# Altium project FourRotorV2.1.PrjPCB
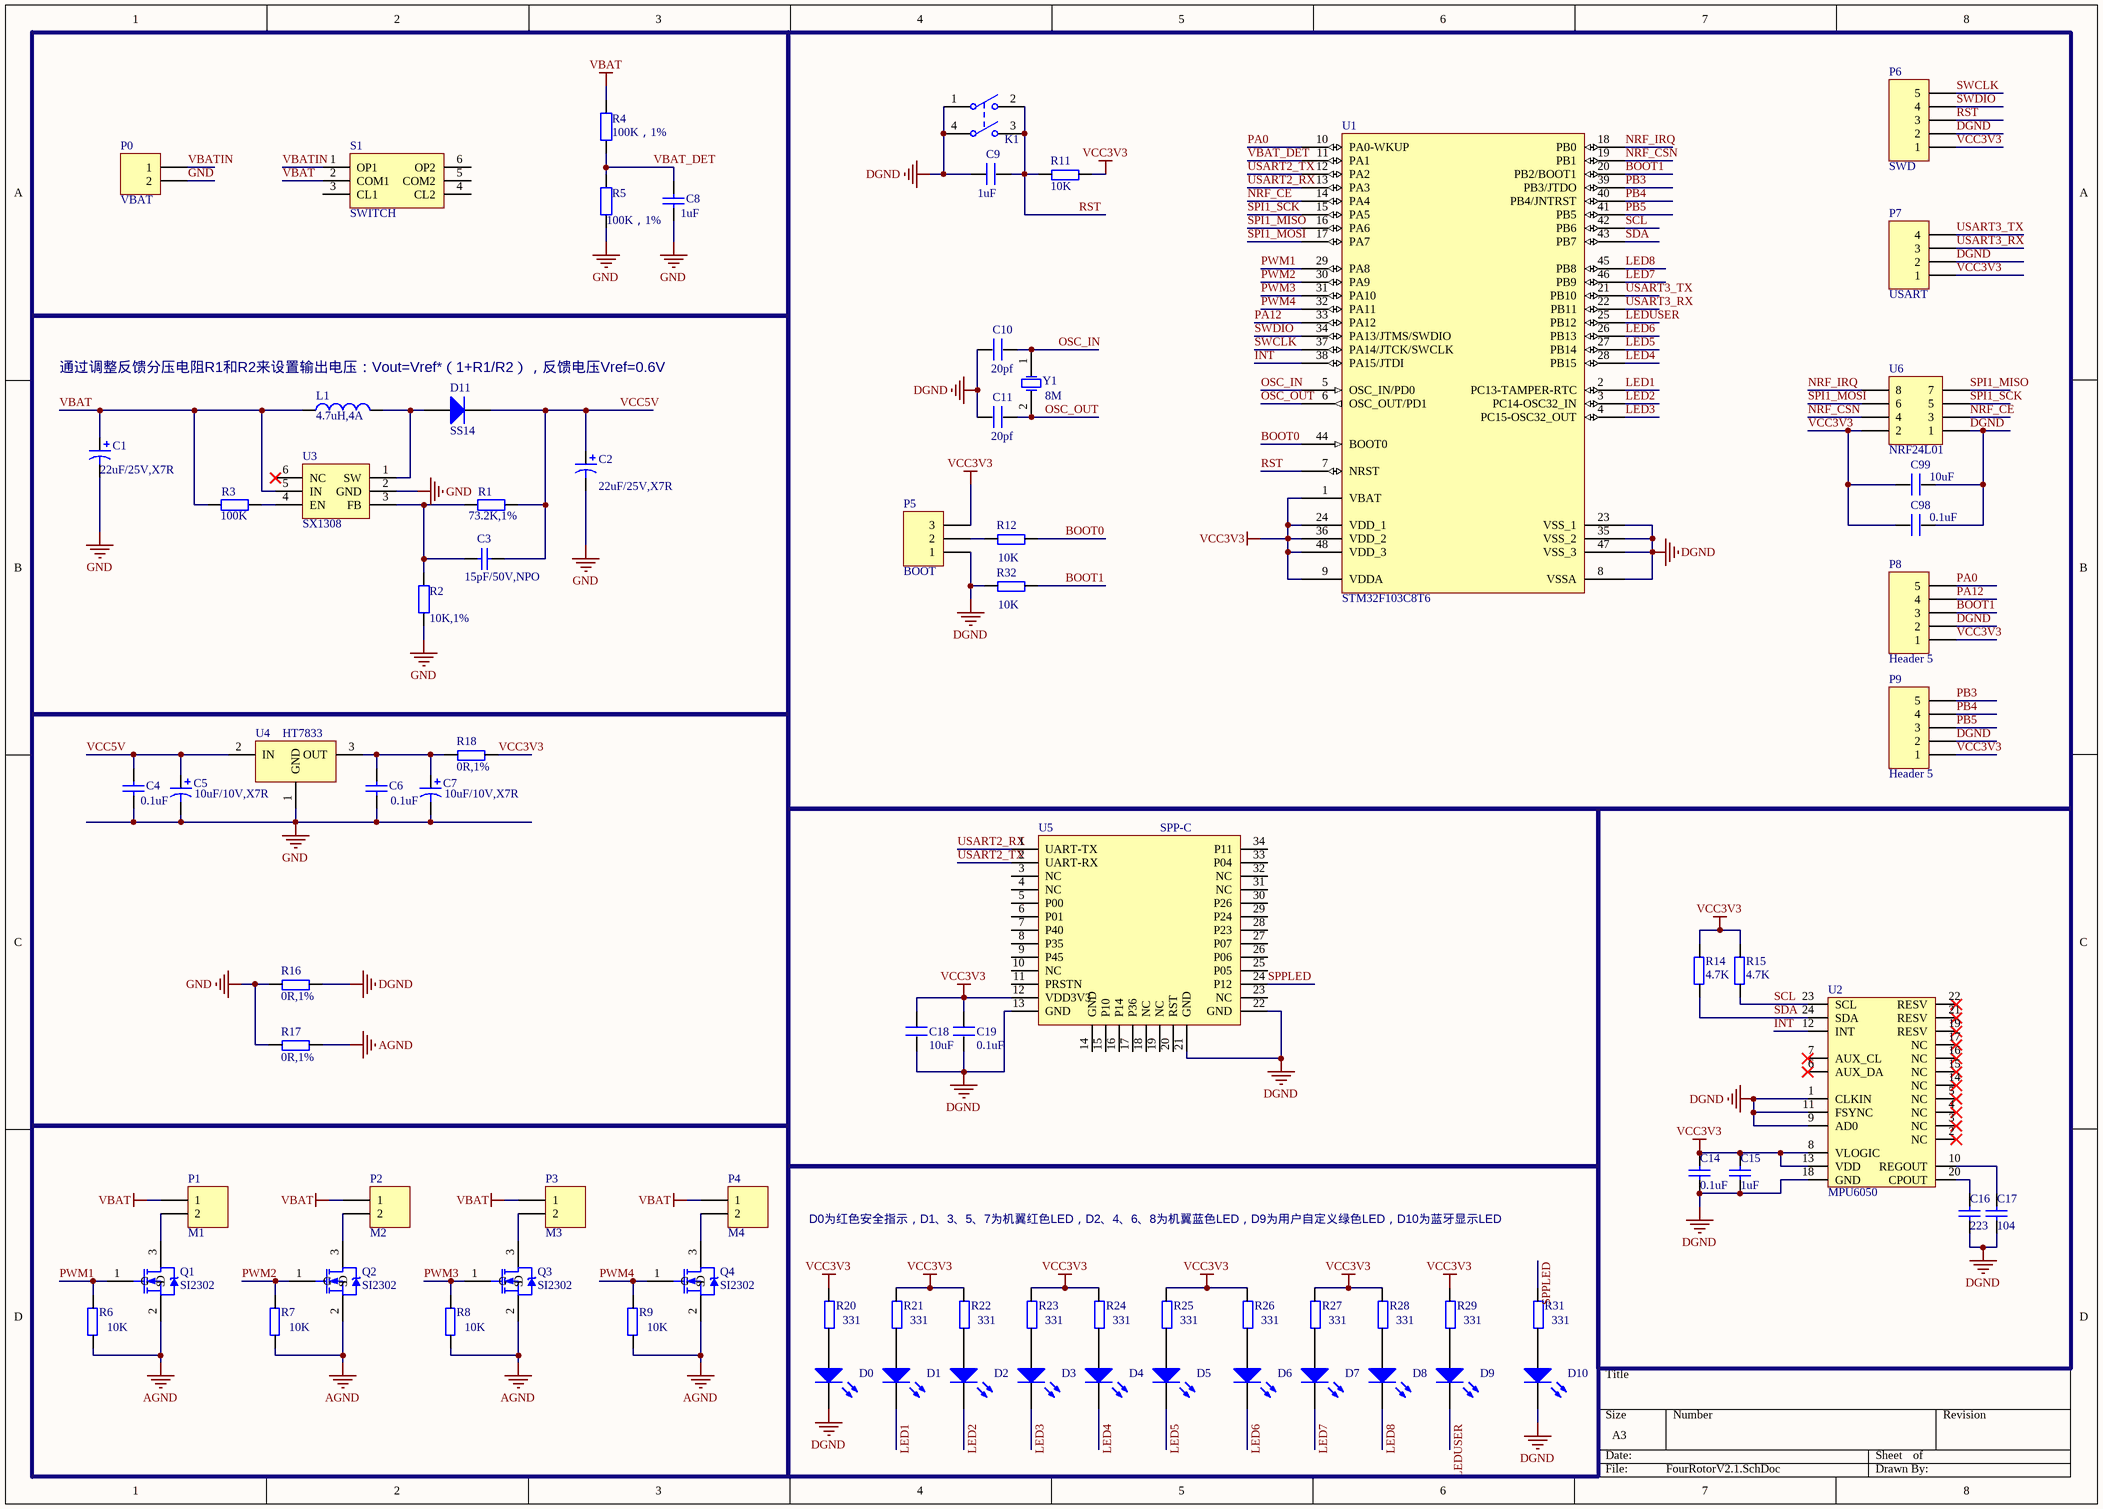
[diagram p0: FourRotorV2.1.SchDoc]
1 sheet, 83 parts. Net scope: global (net labels, ports and power ports of the same name join across sheets).
Board file: FortRotorV2.1.PcbDoc

## Sheet FourRotorV2.1.SchDoc
size A3

### Parts
C1  value 22uF/25V,X7R  [LC-1206_C]  (hidden comment: Cap Pol1)
C2  value 22uF/25V,X7R  [LC-1206_C]  (hidden comment: Cap Pol1)
C3  value 15pF/50V,NPO  [LC-0603_C]  (hidden comment: Cap)
C4  value 0.1uF  [LC-0603_C]  (hidden comment: Cap)
C5  value 10uF/10V,X7R  [LC-1206_C]  (hidden comment: Cap Pol1)
C6  value 0.1uF  [LC-0603_C]  (hidden comment: Cap)
C7  value 10uF/10V,X7R  [LC-1206_C]  (hidden comment: Cap Pol1)
C8  value 1uF  [LC-0603_C]  (hidden comment: Cap)
C9  1uF  [LC-0603_C]
C10  value 20pf  [LC-0603_C]
C11  value 20pf  [LC-0603_C]
C14  value 0.1uF  [LC-0603_C]
C15  value 1uF  [LC-0603_C]
C16  value 223  [LC-0603_C]
C17  value 104  [LC-0603_C]
C18  value 10uF  [LC-0805_C]
C19  value 0.1uF  [LC-0603_C]
C98  value 0.1uF  [LC-0603_C]  (hidden comment: 1uF)
C99  value 10uF  [LC-0805_C]  (hidden comment: 1uF)
D0  LED0  [LC-0805_LED_S1]  (value not drawn)
D1  LED0  [LC-0805_LED_S1]  (value not drawn)
D2  LED0  [LC-0805_LED_S1]  (value not drawn)
D3  LED0  [LC-0805_LED_S1]  (value not drawn)
D4  LED0  [LC-0805_LED_S1]  (value not drawn)
D5  LED0  [LC-0805_LED_S1]  (value not drawn)
D6  LED0  [LC-0805_LED_S1]  (value not drawn)
D7  LED0  [LC-0805_LED_S1]  (value not drawn)
D8  LED0  [LC-0805_LED_S1]  (value not drawn)
D9  LED0  [LC-0805_LED_S1]  (value not drawn)
D10  LED0  [LC-0805_LED_S1]  (value not drawn)
D11  SS14  [LC-DO-214AC]
K1  SW-DPST  [SWITCH2]  (value not drawn)
L1  value 4.7uH,4A  [LC-1812_L]  (hidden comment: Inductor)
P0  VBAT  [HDR1X2]
P1  M1  [HDR1X2]
P2  M2  [HDR1X2]
P3  M3  [HDR1X2]
P4  M4  [HDR1X2]
P5  BOOT  [HDR1X3]
P6  SWD  [HDR1X5]
P7  USART  [HDR1X4]
P8  Header 5  [HDR1X5]
P9  Header 5  [HDR1X5]
Q1  SI2302  [LC-SOT-23(SOT-23-3)]
Q2  SI2302  [LC-SOT-23(SOT-23-3)]
Q3  SI2302  [LC-SOT-23(SOT-23-3)]
Q4  SI2302  [LC-SOT-23(SOT-23-3)]
R1  value 73.2K,1%  [LC-0603_R]  (hidden comment: Res2)
R2  value 10K,1%  [LC-0603_R]  (hidden comment: Res2)
R3  value 100K  [LC-0603_R]  (hidden comment: Res2)
R4  value 100K，1%  [LC-0603_R]  (hidden comment: Res2)
R5  value 100K，1%  [LC-0603_R]  (hidden comment: Res2)
R6  value 10K  [LC-0603_R]
R7  value 10K  [LC-0603_R]
R8  value 10K  [LC-0603_R]
R9  value 10K  [LC-0603_R]
R11  10K  [LC-0603_R]
R12  value 10K  [LC-0603_R]
R14  value 4.7K  [LC-0603_R]
R15  value 4.7K  [LC-0603_R]
R16  value 0R,1%  [LC-0805_R]
R17  value 0R,1%  [LC-0805_R]
R18  value 0R,1%  [LC-0805_R]
R20  value 331  [LC-0603_R]
R21  value 331  [LC-0603_R]
R22  value 331  [LC-0603_R]
R23  value 331  [LC-0603_R]
R24  value 331  [LC-0603_R]
R25  value 331  [LC-0603_R]
R26  value 331  [LC-0603_R]
R27  value 331  [LC-0603_R]
R28  value 331  [LC-0603_R]
R29  value 331  [LC-0603_R]
R31  value 331  [LC-0603_R]
R32  value 10K  [LC-0603_R]
S1  SWITCH  [SWITCH_6]
U1  STM32F103C8T6  [LC-LQFP-48_7x7x05P]
U2  MPU6050  [LC-QFN-24_4x4x05P]
U3  SX1308  [LC-SOT-23-6]
U4  HT7833  [LC-SOT-89(SOT-89-3)]
U5  SPP-C  [SPP-C]
U6  NRF24L01  [LC-HDR2X4H]
Y1  (no value)  [LC-HC-49S]

### Blocks framed on the sheet
通过调整反馈分压电阻R1和R2来设置输出电压：Vout=Vref*（1+R1/R2），反馈电压Vref=0.6V: C1-C3 D11 L1 R1-R3 U3

### Nets
AGND: Q1.2(S) Q2.2(S) Q3.2(S) Q4.2(S) R6.2 R7.2 R8.2 R9.2 R17.2
DGND: C9.1 C10.1 C11.1 C14.1 C15.1 C16.1 C17.1 C18.1 C19.1 C98.2 C99.2 D0.2(K) D10.2(K) K1.1(COMMON1) K1.4(COMMON2) P5.1 P6.2 P7.2 P8.2 P9.2 R16.2 R32.1 U1.8(VSSA) U1.23(VSS_1) U1.35(VSS_2) U1.47(VSS_3) U2.1(CLKIN) U2.9(AD0) U2.11(FSYNC) U2.18(GND) U5.13(GND) U5.21(GND) U5.22(GND) U6.1
GND: C1.2 C2.2 C4.1 C5.2 C6.1 C7.2 C8.1 P0.2 R2.1 R5.1 R16.1 R17.1 U3.2(GND) U4.1(GND)
VBAT: C1.1 L1.1 P1.1 P2.1 P3.1 P4.1 R3.1 R4.2 S1.2(COM1) U3.5(IN)
VCC3V3: C14.2 C15.2 C18.2 C19.2 C98.1 C99.1 P5.3 P6.1 P7.1 P8.1 P9.1 R11.2 R14.1 R15.1 R18.2 R20.2 R21.2 R22.2 R23.2 R24.2 R25.2 R26.2 R27.2 R28.2 R29.2 U1.1(VBAT) U1.9(VDDA) U1.24(VDD_1) U1.36(VDD_2) U1.48(VDD_3) U2.8(VLOGIC) U2.13(VDD) U5.12(VDD3V3) U6.2
BOOT0: R12.2 U1.44(BOOT0)
BOOT1: P8.3 R32.2 U1.20(PB2/BOOT1)
INT: U1.38(PA15/JTDI) U2.12(INT)
LED1: D1.2(K) U1.2(PC13-TAMPER-RTC)
LED2: D2.2(K) U1.3(PC14-OSC32_IN)
LED3: D3.2(K) U1.4(PC15-OSC32_OUT)
LED4: D4.2(K) U1.28(PB15)
LED5: D5.2(K) U1.27(PB14)
LED6: D6.2(K) U1.26(PB13)
LED7: D7.2(K) U1.46(PB9)
LED8: D8.2(K) U1.45(PB8)
LEDUSER: D9.2(K) U1.25(PB12)
NRF_CE: U1.14(PA4) U6.3
NRF_CSN: U1.19(PB1) U6.4
NRF_IRQ: U1.18(PB0) U6.8
OSC_IN: C10.2 U1.5(OSC_IN/PD0) Y1.1(OSC1)
OSC_OUT: C11.2 U1.6(OSC_OUT/PD1) Y1.2(OSC2)
PA0: P8.5 U1.10(PA0-WKUP)
PA12: P8.4 U1.33(PA12)
PB3: P9.5 U1.39(PB3/JTDO)
PB4: P9.4 U1.40(PB4/JNTRST)
PB5: P9.3 U1.41(PB5)
PWM1: Q1.1(G) R6.1 U1.29(PA8)
PWM2: Q2.1(G) R7.1 U1.30(PA9)
PWM3: Q3.1(G) R8.1 U1.31(PA10)
PWM4: Q4.1(G) R9.1 U1.32(PA11)
RST: C9.2 K1.2(NO1) K1.3(NO2) P6.3 R11.1 U1.7(NRST)
SCL: R15.2 U1.42(PB6) U2.23(SCL)
SDA: R14.2 U1.43(PB7) U2.24(SDA)
SPI1_MISO: U1.16(PA6) U6.7
SPI1_MOSI: U1.17(PA7) U6.6
SPI1_SCK: U1.15(PA5) U6.5
SPPLED: R31.2 U5.24(P12)
SWCLK: P6.5 U1.37(PA14/JTCK/SWCLK)
SWDIO: P6.4 U1.34(PA13/JTMS/SWDIO)
USART2_RX: U1.13(PA3) U5.1(UART-TX)
USART2_TX: U1.12(PA2) U5.2(UART-RX)
USART3_RX: P7.3 U1.22(PB11)
USART3_TX: P7.4 U1.21(PB10)
VBAT_DET: C8.2 R4.1 R5.2 U1.11(PA1)
VBATIN: P0.1 S1.1(OP1)
VCC5V: C2.1 C3.2 C4.2 C5.1 D11.2(K) R1.2 U4.2(IN)
NetC3_1: C3.1 R1.1 R2.2 U3.3(FB)
NetC6_2: C6.2 C7.1 R18.1 U4.3(OUT)
NetC16_2: C16.2 U2.20(CPOUT)
NetC17_2: C17.2 U2.10(REGOUT)
NetD0_1: D0.1(A) R20.1
NetD1_1: D1.1(A) R21.1
NetD2_1: D2.1(A) R22.1
NetD3_1: D3.1(A) R23.1
NetD4_1: D4.1(A) R24.1
NetD5_1: D5.1(A) R25.1
NetD6_1: D6.1(A) R26.1
NetD7_1: D7.1(A) R27.1
NetD8_1: D8.1(A) R28.1
NetD9_1: D9.1(A) R29.1
NetD10_1: D10.1(A) R31.1
NetD11_1: D11.1(A) L1.2 U3.1(SW)
NetP1_2: P1.2 Q1.3(D)
NetP2_2: P2.2 Q2.3(D)
NetP3_2: P3.2 Q3.3(D)
NetP4_2: P4.2 Q4.3(D)
NetP5_2: P5.2 R12.1
NetR3_2: R3.2 U3.4(EN)

Not connected (* = marked no-connect by the designer): S1 3(CL1) 4(CL2) 5(COM2) 6(OP2); U2 2(NC)* 3(NC)* 4(NC)* 5(NC)* 6(AUX_DA)* 7(AUX_CL)* 14(NC)* 15(NC)* 16(NC)* 17(NC)* 19(RESV)* 21(RESV)* 22(RESV)*; U3 6(NC)*; U5 3(NC) 4(NC) 5(P00) 6(P01) 7(P40) 8(P35) 9(P45) 10(NC) 11(PRSTN) 14(GND) 15(P10) 16(P14) 17(P36) 18(NC) 19(NC) 20(RST) 23(NC) 25(P05) 26(P06) 27(P07) 28(P23) 29(P24) 30(P26) 31(NC) 32(NC) 33(P04) 34(P11)

### Notes on the sheet
- D0为红色安全指示，D1、3、5、7为机翼红色LED，D2、4、6、8为机翼蓝色LED，D9为用户自定义绿色LED，D10为蓝牙显示LED
- (in symbol XTAL) 8M

### Library data of the parts
C1 C2 C5 C7 = Cap Pol1: Polarized Capacitor (Radial); Published: 8-Jun-2000; LatestRevisionDate: 17-Jul-2002; LatestRevisionNote: Re-released for DXP Platform.; PackageReference: RB7.6-15; Publisher: Altium Limited
C3 C4 C6 C8 C14-C17 = Cap: Capacitor; Published: 8-Jun-2000; LatestRevisionDate: 17-Jul-2002; LatestRevisionNote: Re-released for DXP Platform.; PackageReference: RAD-0.3; Publisher: Altium Limited
  C14-C17: PackageDescription: Radial Cap, Thru-Hole; 2 Leads; 0.3 in Pin Spacing
C9 C98 C99 = C_1
  C9: value: 1uF
C10 C11 C18 C19 = C
D0-D10 = LED0: Typical INFRARED GaAs LED; Published: 8-Jun-2000; LatestRevisionDate: 08-Jul-2005; LatestRevisionNote: Mech Layer 1 removed.; PackageReference: LED-0; Publisher: Altium Limited
D11 = Diode 1N4001: 1 Amp General Purpose Rectifier; Published: 8-Jun-2000; LatestRevisionDate: 17-Jul-2002; LatestRevisionNote: Re-released for DXP Platform.; DatasheetDocument: 1998; PackageDocument: Aug-1999; PackageReference: DO-41; Publisher: Altium Limited; Code_JEDEC: DO-204-AL; ComponentLink1Description: Manufacturer Link; ComponentLink1URL: http://www.fairchildsemi.com/; ComponentLink2Description: Datasheet; ComponentLink2URL: http://www.fairchildsemi.com/ds/1N%2F1N4001.pdf
K1 = SW-DPST: Double-Pole, Single-Throw Switch; Published: 24-Mar-1999; LatestRevisionDate: 17-Jul-2002; LatestRevisionNote: Re-released for DXP Platform.; PackageReference: DPST-4; Publisher: Altium Limited
L1 = Inductor: Code_IEC: 1005; Published: 8-Jun-2000; LatestRevisionDate: 17-Jul-2002; LatestRevisionNote: Re-released for DXP Platform.; PackageReference: 0402-A; Publisher: Altium Limited; Code_JEITA: 0402
P0-P4 = Header 2: Header, 2-Pin; LatestRevisionDate: 17-Jul-2002; LatestRevisionNote: Re-released for DXP Platform.; Publisher: Altium Limited
P5 = Header 3: Header, 3-Pin; LatestRevisionDate: 17-Jul-2002; LatestRevisionNote: Re-released for DXP Platform.; Publisher: Altium Limited
P6 P8 P9 = Header 5: Header, 5-Pin; LatestRevisionDate: 17-Jul-2002; LatestRevisionNote: Re-released for DXP Platform.; Publisher: Altium Limited
P7 = Header 4: Header, 4-Pin; LatestRevisionDate: 17-Jul-2002; LatestRevisionNote: Re-released for DXP Platform.; Publisher: Altium Limited
Q1-Q4 = NMOS-2: N-Channel Power MOSFET; Note: Pin 2 is electrically connected to pin 4.; Published: 8-Jun-2000; LatestRevisionDate: 17-Jul-2002; LatestRevisionNote: Re-released for DXP Platform.; DatasheetVersion: PD-9.814; PackageVersion: Feb-1997; PackageReference: TO-220AB; Publisher: Altium Limited; PackageDescription: TO, Thru-Hole, Vertical, Heatsink Mounted; 3 In-Line Leads; Pitch 2.54 mm; ComponentLink1Description: Manufacturer Link; ComponentLink1URL: http://www.irf.com/
R1-R5 = Res2: Resistor; Published: 8-Jun-2000; LatestRevisionDate: 17-Jul-2002; LatestRevisionNote: Re-released for DXP Platform.; PackageReference: AXIAL-0.4; Publisher: Altium Limited
R6-R9 R12 R16-R18 R32 = R
R11 R14 R15 R20-R29 R31 = R_1
  R11: value: 10K
U1 = STM32F103C8T6: STM32 ARM-based 32-bit MCU with 64 Kbytes Flash, 48-pin LQFP, Industrial Temperature; Published: 30-May-2008; DatasheetVersion: rev6, Mar-2008; PackageVersion: Mar-2008; PackageReference: LQFP48; Publisher: Altium Limited; PackageDescription: 48-Pin Low-Profile Quad Flat Pack, 7 x 7 mm Body, 0.5 mm Pitch (LQFP48); ComponentLink1Description: Manufacturer Link; ComponentLink1URL: www.st.com/stm32; ComponentLink2Description: Datasheet; ComponentLink2URL: http://www.st.com/stonline/products/literature/ds/13587.pdf
U2 = MPU6050: 9轴运动处理传感器
U6 = Header 4X2H: Header, 4-Pin, Dual row, Right Angle; LatestRevisionDate: 17-Jul-2002; LatestRevisionNote: Re-released for DXP Platform.; Publisher: Altium Limited
Y1 = XTAL: Crystal Oscillator; Published: 8-Jun-2000; LatestRevisionDate: 17-Jul-2002; LatestRevisionNote: Re-released for DXP Platform.; Publisher: Altium Limited